# EAGLE design berlingo synth (EAGLE 6.6.0)
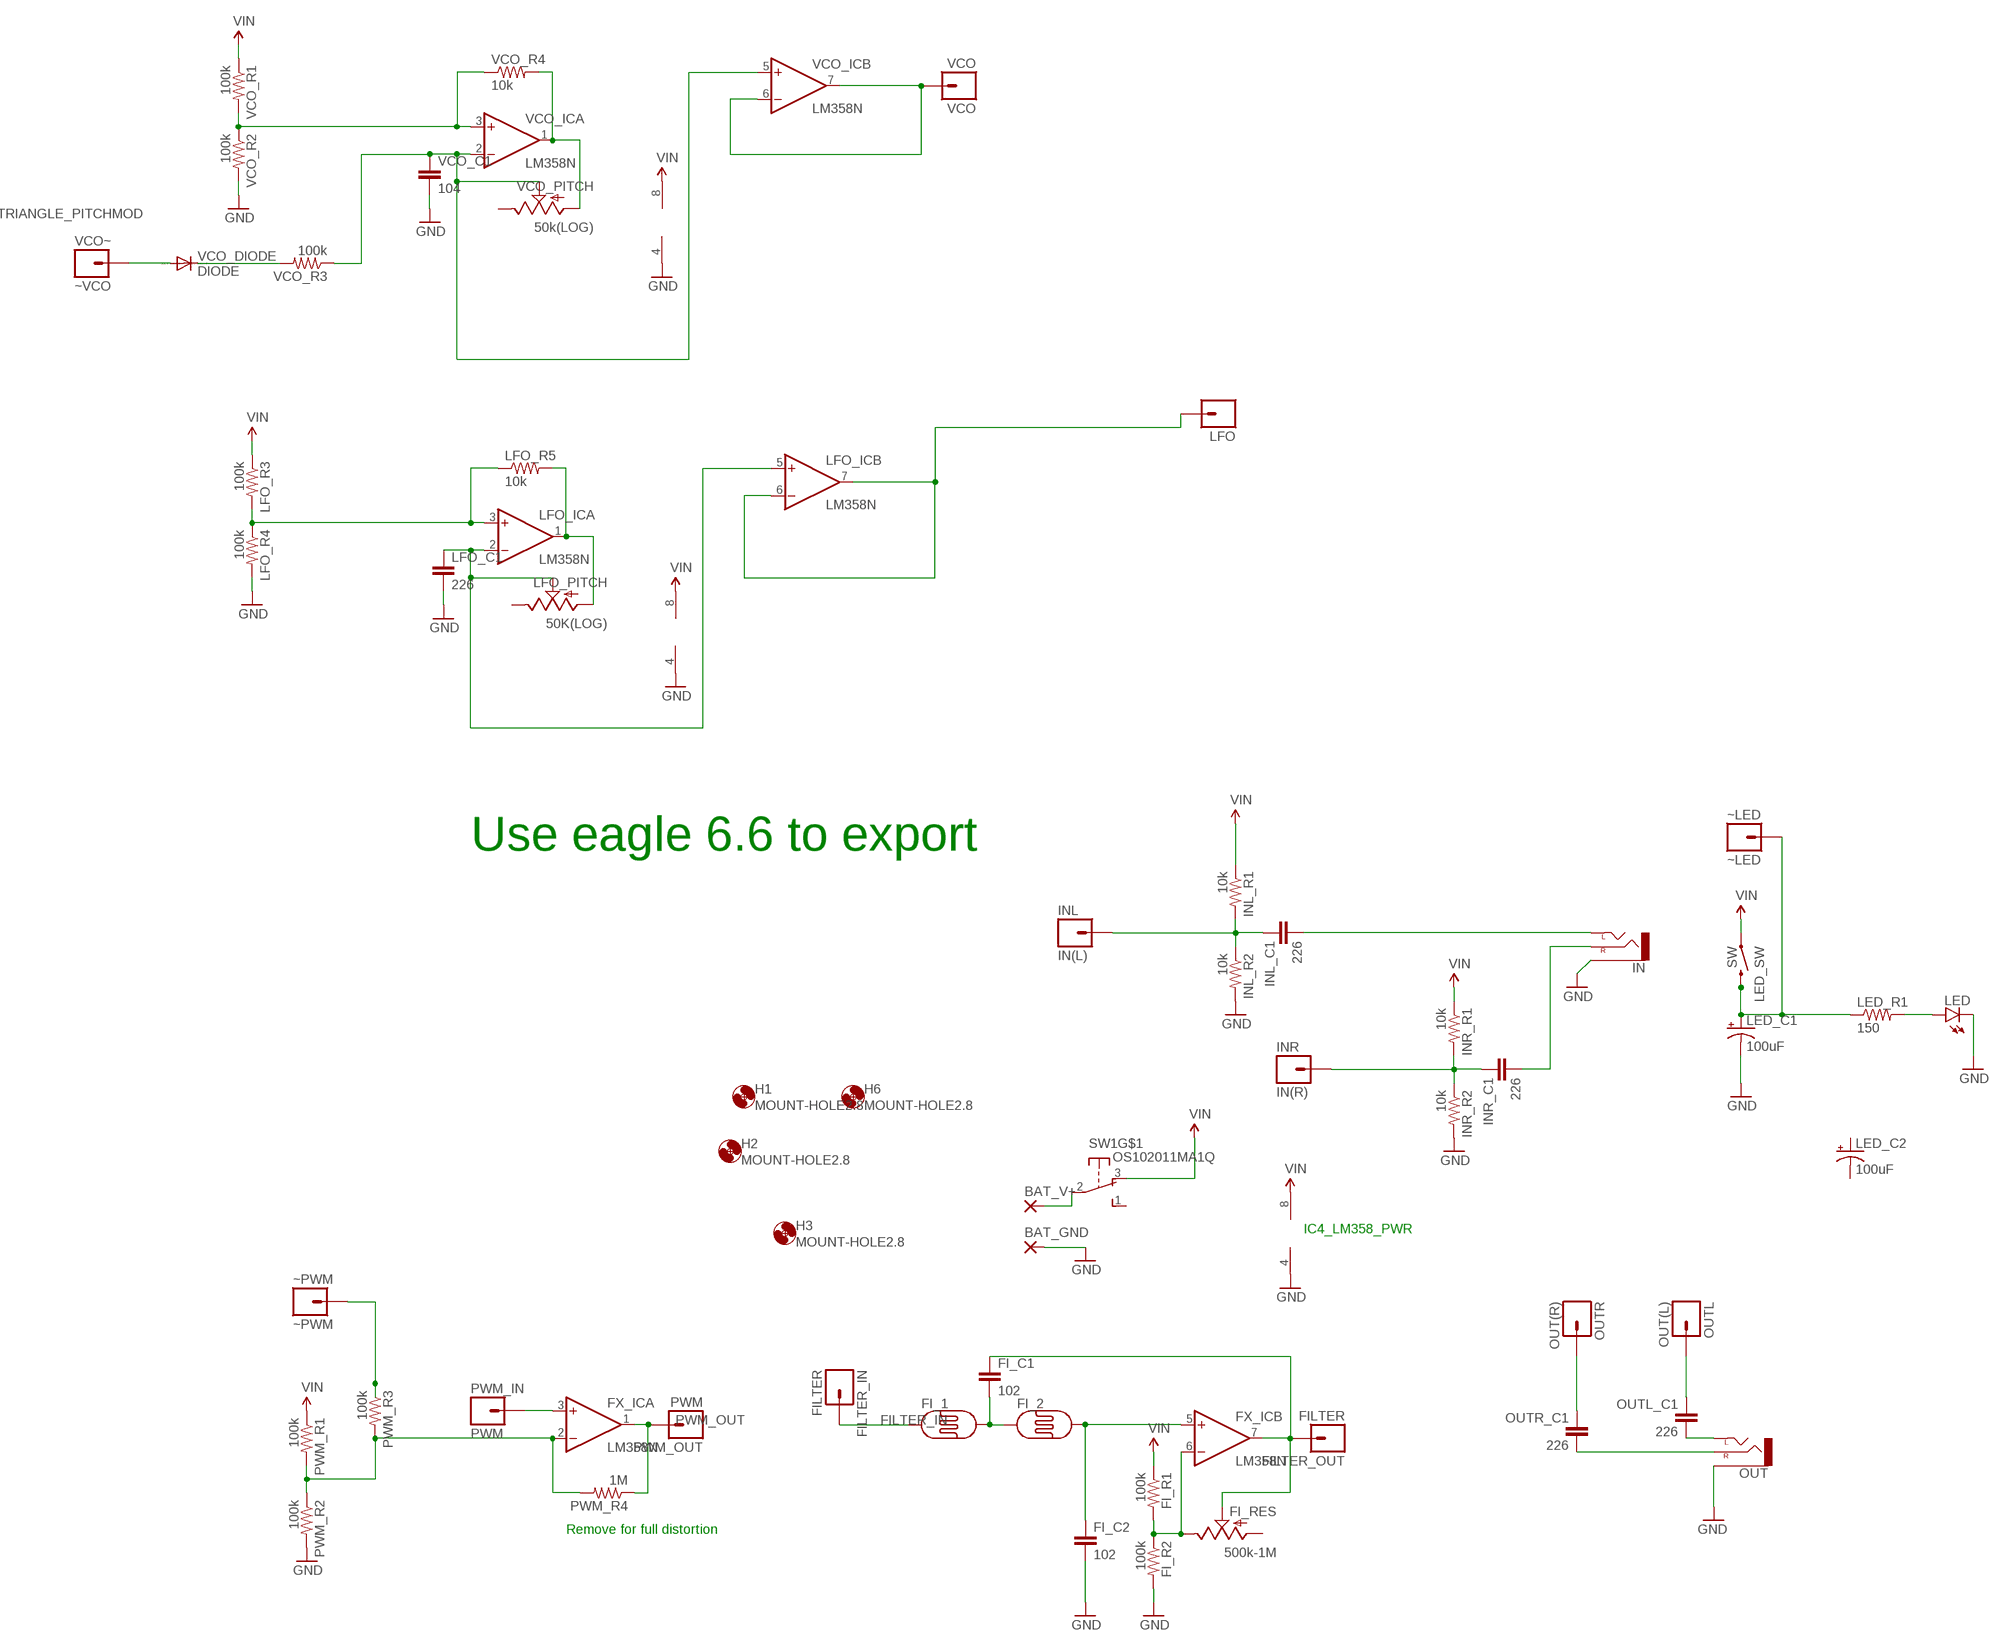
[diagram p0: schematic, sheet 1]

## Parts
BAT_GND  3,81/1,4  [3,81/1,4]
BAT_V+  3,81/1,4  [3,81/1,4]
FI_1  PHOTOCELLPTH  [PHOTOCELL]
FI_2  PHOTOCELLPTH  [PHOTOCELL]
FI_C1  102  CAPEZ  [CAP-PTH-SMALLEZ]
FI_C2  102  CAPEZ  [CAP-PTH-SMALLEZ]
FI_R1  100k  R-US_0207/10  [0207/10]
FI_R2  100k  R-US_0207/10  [0207/10]
FI_RES  500k-1M  POT  [ALPS_POT]
FILTER_IN  FILTER  HEADER-1X1  [1X01_SIDE_NAME]
FILTER_OUT  FILTER  HEADER-1X1  [1X01_SIDE_NAME]
FX_IC  LM358N  [DIL08]
H1  MOUNT-HOLE2.8  [2,8]
H2  MOUNT-HOLE2.8  [2,8]
H3  MOUNT-HOLE2.8  [2,8]
H6  MOUNT-HOLE2.8  [2,8]
IN  AUDIO-JACKPTH  [AUDIO-JACK]
INL  IN(L)  HEADER-1X1  [1X01_SIDE_NAME]
INL_C1  226  CAPEZ  [CAP-PTH-SMALLEZ]
INL_R1  10k  R-US_0207/10  [0207/10]
INL_R2  10k  R-US_0207/10  [0207/10]
INR  IN(R)  HEADER-1X1  [1X01_SIDE_NAME]
INR_C1  226  CAPEZ  [CAP-PTH-SMALLEZ]
INR_R1  10k  R-US_0207/10  [0207/10]
INR_R2  10k  R-US_0207/10  [0207/10]
LED  LED5MM  [LED5MM]
LED_C1  100uF  CPOL-USE2-4  [E2-4]
LED_C2  100uF  CPOL-USE2.5-6  [E2,5-6]
LED_R1  150  R-US_0207/10  [0207/10]
LED_SW  SW  SWITCH-MOMENTARY-212MM  [TACTILE-PTH-12MM]
LFO  HEADER-1X1  [1X01_SIDE_NAME]
LFO_C1  226  CAPEZ  [CAP-PTH-SMALLEZ]
LFO_IC  LM358N  [DIL08]
LFO_PITCH  50K(LOG)  POT  [ALPS_POT]
LFO_R3  100k  R-US_0207/10  [0207/10]
LFO_R4  100k  R-US_0207/10  [0207/10]
LFO_R5  10k  R-US_0207/10  [0207/10]
OUT  AUDIO-JACKPTH  [AUDIO-JACK]
OUTL  OUT(L)  HEADER-1X1  [1X01_SIDE_NAME]
OUTL_C1  226  CAPEZ  [CAP-PTH-SMALLEZ]
OUTR  OUT(R)  HEADER-1X1  [1X01_SIDE_NAME]
OUTR_C1  226  CAPEZ  [CAP-PTH-SMALLEZ]
PWM_IN  PWM  HEADER-1X1  [1X01_SIDE_NAME]
PWM_OUT  PWM  HEADER-1X1  [1X01_SIDE_NAME]
PWM_R1  100k  R-US_0207/10  [0207/10]
PWM_R2  100k  R-US_0207/10  [0207/10]
PWM_R3  100k  R-US_0207/10  [0207/10]
PWM_R4  1M  R-US_0207/10  [0207/10]
SW1  OS102011MA1Q  [OS102011MA1Q]
VCO  VCO  HEADER-1X1  [1X01_SIDE_NAME]
VCO_C1  104  CAPEZ  [CAP-PTH-SMALLEZ]
VCO_DIODE  DIODE  1N4004  [DO41-10]
VCO_IC  LM358N  [DIL08]
VCO_PITCH  50k(LOG)  POT  [ALPS_POT]
VCO_R1  100k  R-US_0207/10  [0207/10]
VCO_R2  100k  R-US_0207/10  [0207/10]
VCO_R3  100k  R-US_0207/10  [0207/10]
VCO_R4  10k  R-US_0207/10  [0207/10]
VCO~  ~VCO  HEADER-1X1  [1X01_SIDE_NAME]
~LED  ~LED  HEADER-1X1  [1X01_SIDE_NAME]
~PWM  ~PWM  HEADER-1X1  [1X01_SIDE_NAME]

## Nets
FILTER_IN: FI_1.1 FILTER_IN.1
FILTER_OUT: FI_C1.1 FI_RES.P$2(S) FILTER_OUT.1 FX_IC.7(B:OUT)
GND: BAT_GND.1(P) FI_C2.2 FI_R2.2 FX_IC.4(P:V-) IN.SLEEVE INL_R2.2 INR_R2.2 LED.K(C) LED_C1.- LFO_C1.2 LFO_IC.4(P:V-) LFO_R4.2 OUT.SLEEVE PWM_R2.2 VCO_C1.2 VCO_IC.4(P:V-) VCO_R2.2
LFO: LFO.1 LFO_IC.6(B:-IN) LFO_IC.7(B:OUT)
MOD_IN: FX_IC.3(A:+IN) PWM_IN.1
N$1: BAT_V+.1(P) SW1.2(P)
N$2: VCO_DIODE.C VCO_R3.2
N$3: FX_IC.2(A:-IN) PWM_R1.2 PWM_R2.1 PWM_R3.2 PWM_R4.2
N$4: VCO_IC.3(A:+IN) VCO_R1.2 VCO_R2.1 VCO_R4.1
N$5: PWM_R3.1 ~PWM.1
N$6: LED.A LED_R1.2
N$7: FI_2.2 FI_C2.1 FX_IC.5(B:+IN)
N$8: FI_1.2 FI_2.1 FI_C1.2
N$9: OUTR.1 OUTR_C1.1
N$10: VCO_IC.1(A:OUT) VCO_PITCH.P$3(A) VCO_R4.2
N$11: OUT.TIP(LEFT) OUTL_C1.2
N$12: OUTL.1 OUTL_C1.1
N$13: LED_C1.+ LED_R1.1 LED_SW.3 ~LED.1
N$14: INR.1 INR_C1.1 INR_R1.2 INR_R2.1
N$15: IN.RING(RIGHT) INR_C1.2
N$16: FI_R1.2 FI_R2.1 FI_RES.P$1(E) FX_IC.6(B:-IN)
N$17: LFO_IC.3(A:+IN) LFO_R3.2 LFO_R4.1 LFO_R5.1
N$18: VCO_C1.1 VCO_IC.2(A:-IN) VCO_IC.5(B:+IN) VCO_PITCH.P$2(S) VCO_R3.1
N$19: INL.1 INL_C1.1 INL_R1.2 INL_R2.1
N$20: IN.TIP(LEFT) INL_C1.2
N$21: LFO_IC.1(A:OUT) LFO_PITCH.P$3(A) LFO_R5.2
N$22: LFO_C1.1 LFO_IC.2(A:-IN) LFO_IC.5(B:+IN) LFO_PITCH.P$2(S)
N$23: VCO.1 VCO_IC.6(B:-IN) VCO_IC.7(B:OUT)
N$24: OUT.RING(RIGHT) OUTR_C1.2
PWM_OUT: FX_IC.1(A:OUT) PWM_OUT.1 PWM_R4.1
TRIANGLE_PITCHMOD: VCO_DIODE.A VCO~.1
VIN: FI_R1.1 FX_IC.8(P:V+) INL_R1.1 INR_R1.1 LED_SW.1 LFO_IC.8(P:V+) LFO_R3.1 PWM_R1.1 SW1.3(O) VCO_IC.8(P:V+) VCO_R1.1
Unconnected: FI_RES.P$3(A) LED_C2.+ LED_C2.- LFO_PITCH.P$1(E) SW1.1(S) SW1.MT1(MT) SW1.MT2(MT) VCO_PITCH.P$1(E)

## Notes on the sheet
- Use eagle 6.6 to export
- IC4_LM358_PWR
- Remove for full distortion

## Library data of the parts
BAT_GND BAT_V+ = wirepad:3,81/1,4: THROUGH-HOLE PAD
FI_1 FI_2 = SparkFun-Sensors:PHOTOCELL: CdS photoresistor. This is a low cost way to detect light levels. Resistance decreases with more incoming light. SparkFun SKU: SEN-09088
FI_C1 FI_C2 INL_C1 INR_C1 LFO_C1 OUTL_C1 OUTR_C1 VCO_C1 = SparkFun-Capacitors:CAP: Capacitor Standard 0603 ceramic capacitor, and 0.1" leaded capacitor.
FI_R1 FI_R2 INL_R1 INL_R2 INR_R1 INR_R2 LED_R1 LFO_R3-LFO_R5 PWM_R1-PWM_R4 VCO_R1-VCO_R4 = resistor:R-US_: RESISTOR, American symbol
FI_RES LFO_PITCH VCO_PITCH = SparkFun-Electromechanical:POT; PROD_ID: RES-09177
FILTER_IN FILTER_OUT INL INR LFO OUTL OUTR PWM_IN PWM_OUT VCO VCO~ ~LED ~PWM = TOF:HEADER-1X1: Header 1 Standard 1-pin 0.1" header. Use with straight break away headers (SKU : PRT-00116), right angle break away headers (PRT-00553), swiss pins (PRT-00743), machine pins (PRT-00117), and female headers (PRT-00115).
FX_IC LFO_IC VCO_IC = linear:LM358: OP AMP also LM158; LM258; LM2904 Source: http://cache.national.com/ds/LM/LM158.pdf
H1-H3 H6 = holes:MOUNT-HOLE: MOUNTING HOLE with drill center marker
IN OUT = SparkFun-Connectors:AUDIO-JACK: 3.5mm Audio Jack Simple 3.5mm common PCB mount audio jack. Variant PTH is our storefront SKU PRT-08032
LED = SparkFun-LED:LED: LEDs Standard schematic elements and footprints for 5mm, 3mm, 1206, and 0603 sized LEDs. 5mm - Spark Fun Electronics SKU : COM-00529 (and others)
LED_C1 LED_C2 = rcl:CPOL-US: POLARIZED CAPACITOR, American symbol
LED_SW = SparkFun-Electromechanical:SWITCH-MOMENTARY-2: Various NO switches- pushbuttons, reed, etc; PROD_ID: SWCH-09185
SW1 = adafruit:OS102011MA1Q: OS10201MA1Q through-hole right angle switch http://www.ladyada.net/library/eagle
VCO_DIODE = diode:1N4004: DIODE general purpose rectifier, 1 A

## Board
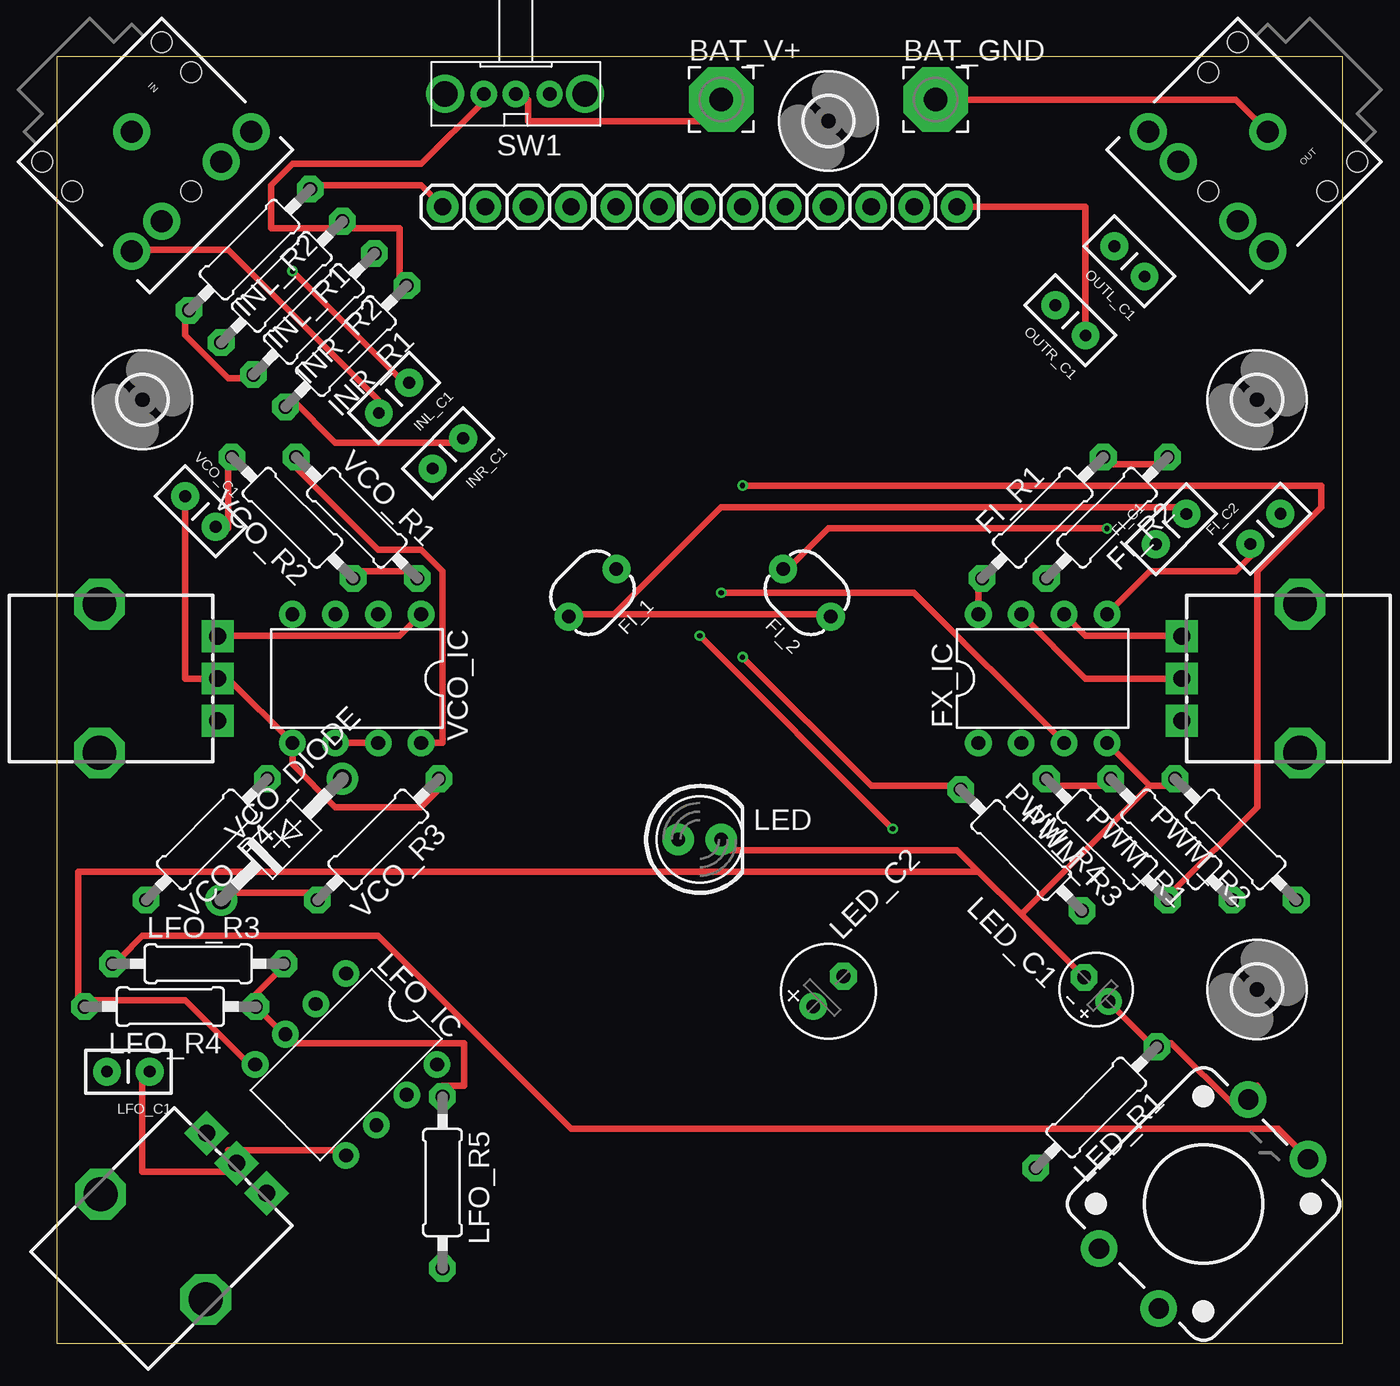
[diagram p1: board, top side]
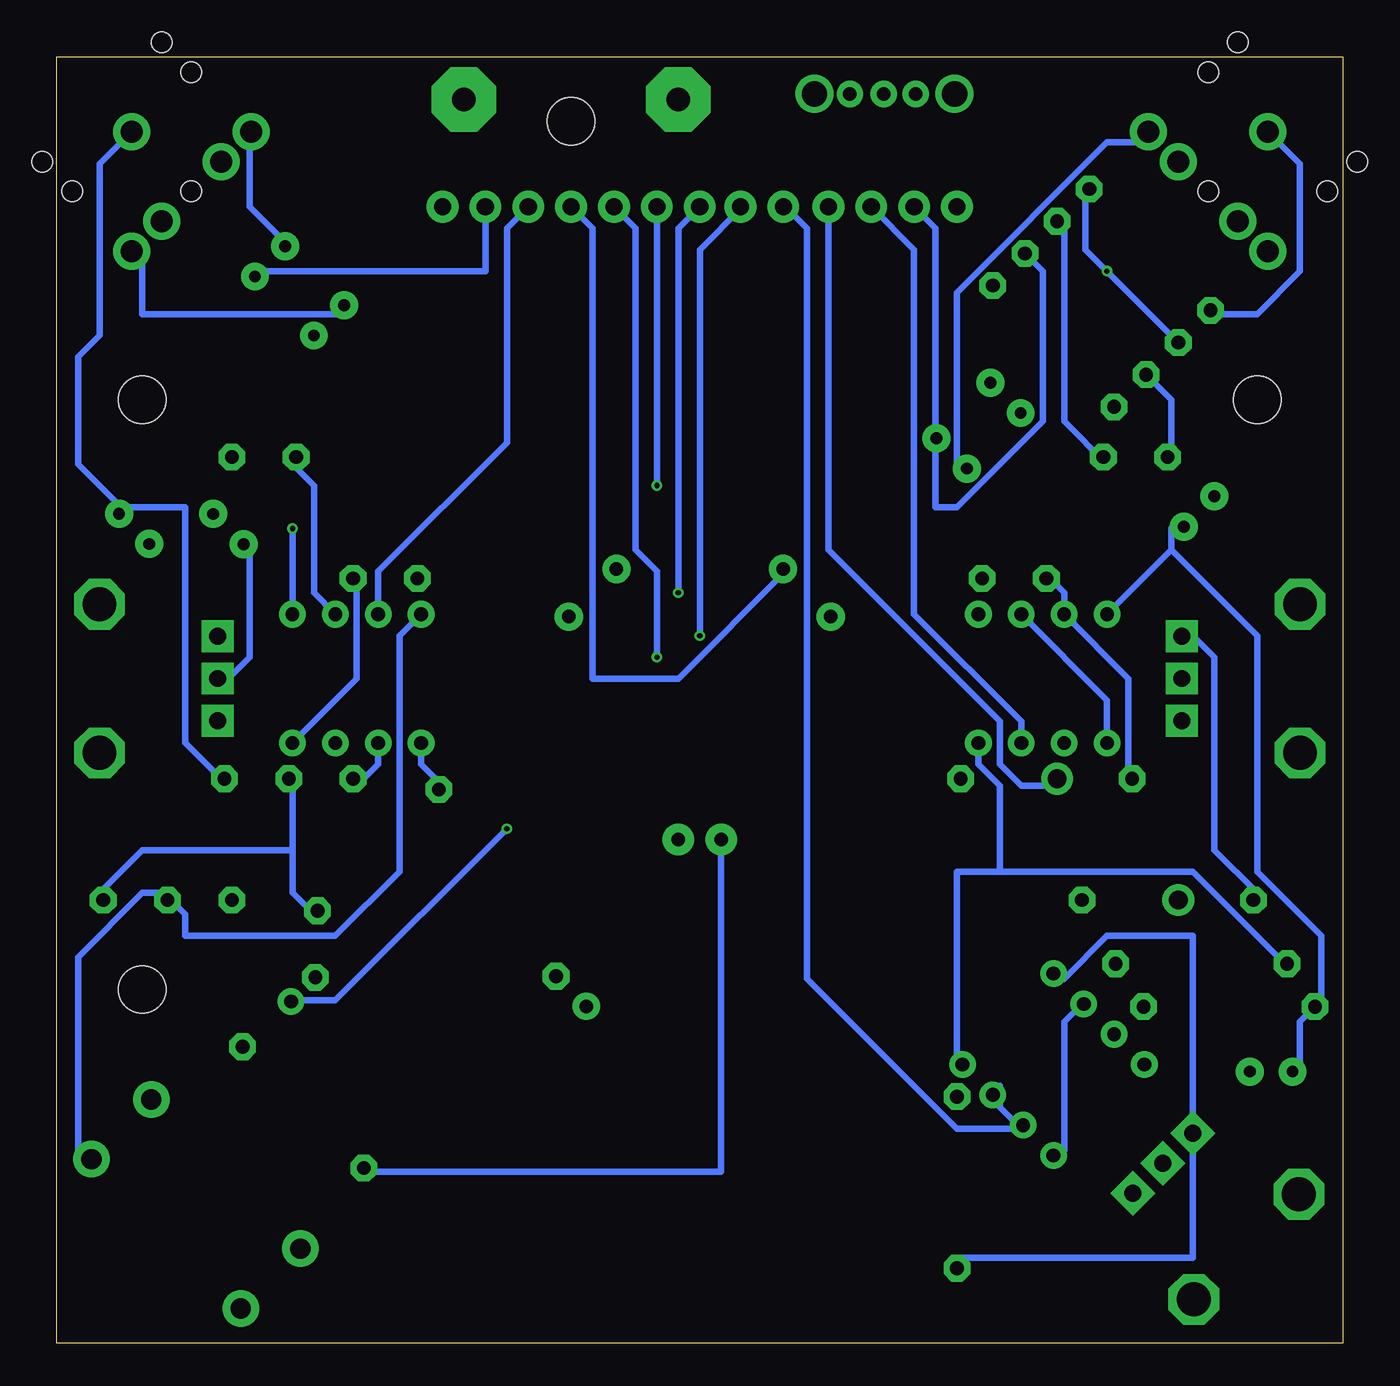
[diagram p2: board, bottom side, seen from below]

Size 76.2 x 76.2 mm. Coordinates in mm from the lower left corner, seen from the top.
Outline: 0,0 76.2,0 76.2,76.2 0,76.2 0,0
Copper layers (1*16): Top 0.035mm / dielectric 1.5mm / Bottom 0.035mm
Design rules "EagleRules *": minimum track width 15mil, minimum drill 12mil, track to track 7mil, track to pad 7mil, pad to pad 7mil, via to via 7mil, smd to smd 0mil, copper to edge 20mil, drill to drill 10mil, minimum pad ring 15mil, minimum via ring 6mil, stop-mask expansion 2mil, vias tented up to drill 25mil, thermal gap 10mil

### Footprints (pad centres in the part's own frame; a part is rotated, then mirrored left to right if it is on the bottom)
3,81/1,4 = drill 1.397 pad 3.81 octagon: 1 0,0
PHOTOCELL = drill 0.8 pad 1.676: 1 -2,0; 2 2,0
CAP-PTH-SMALLEZ = drill 0.7 pad 1.651: 1 0,0; 2 2.54,0
0207/10 = drill 0.813 octagon: 1 -5.08,0; 2 5.08,0
ALPS_POT = drill 1 pad 1.88 square: P$1 7,-2.5; P$2 7,0; P$3 7,2.5 | drill 2 octagon: P$4 0,-4.4; P$5 0,4.4
1X01_SIDE_NAME = drill 1.016 pad 1.88: 1 0,0
DIL08 = drill 0.813 pad 1.27: 1 -3.81,-3.81; 2 -1.27,-3.81; 3 1.27,-3.81; 4 3.81,-3.81; 5 3.81,3.81; 6 1.27,3.81; 7 -1.27,3.81; 8 -3.81,3.81
2,8 = hole 2.8: 0,0
AUDIO-JACK = drill 1.3 pad 2.184: RING 5,5; RSH 5,2.5; SLEEVE 0,0; TIP 5,-5; TSH 5,-2.5 | hole 1.2: 0,5; -2.5,5; -2.5,-5; 0,-5; 5,0
LED5MM = drill 0.813 pad 1.88: A -1.27,0; K 1.27,0
E2-4 = drill 0.813 pad 1.27: + -1.016,0 | drill 0.813 pad 1.27 octagon: - 1.016,0
E2,5-6 = drill 0.813 pad 1.6: + -1.27,0 | drill 0.813 pad 1.6 octagon: - 1.27,0
TACTILE-PTH-12MM = drill 1.2 pad 2.159: 1 6.25,-2.5; 2 -6.25,-2.5; 3 6.25,2.5; 4 -6.25,2.5
OS102011MA1Q = drill 0.8 pad 1.422: 1 -2,0; 2 0,0; 3 1.9,0 | drill 1.5 pad 2.184: MT1 -4.1,0; MT2 4.2,0
DO41-10 = drill 1.118: A 5.08,0; C -5.08,0

### Placement (x,y rotation side)
BAT_GND  52.07,73.66 0 top
BAT_V+  39.37,73.66 0 top
FI_1  31.75,44.45 225 top
FI_2  44.45,44.45 135 top
FI_C1  65.12,47.32 45 top
FI_C2  70.71,47.34 45 top
FI_R1  58.42,48.9 45 top
FI_R2  62.23,48.9 225 top
FI_RES  73.66,39.37 180 top
FILTER_IN  45.72,67.31 270 top
FILTER_OUT  48.26,67.31 270 top
FX_IC  58.42,39.37 0 top
H1  71.12,55.88 0 top
H2  71.12,20.95 0 top
H3  45.72,72.39 0 top
H6  5.08,55.88 0 top
IN  4.45,71.75 315 top
INL  22.86,67.31 270 top
INL_C1  20.88,56.9 225 top
INL_R1  13.34,62.87 225 top
INL_R2  11.43,64.77 225 top
INR  25.4,67.31 270 top
INR_C1  24.08,53.6 225 top
INR_R1  17.14,59.05 225 top
INR_R2  15.24,60.96 225 top
LED  38.1,29.84 0 top
LED_C1  61.59,20.95 135 top
LED_C2  45.72,20.85 45 top
LED_R1  61.59,13.97 225 top
LED_SW  67.94,8.26 45 top
LFO  33.15,67.31 270 top
LFO_C1  5.52,16.09 180 top
LFO_IC  17.14,16.51 225 top
LFO_PITCH  5.71,5.71 45 top
LFO_R3  8.38,22.48 0 top
LFO_R4  6.73,19.94 180 top
LFO_R5  22.86,9.53 270 top
OUT  71.75,71.75 225 top
OUTL  50.8,67.31 270 top
OUTL_C1  64.45,63.18 135 top
OUTR  53.34,67.31 270 top
OUTR_C1  60.96,59.69 135 top
PWM_IN  38.1,67.31 270 top
PWM_OUT  43.18,67.31 270 top
PWM_R1  66.04,29.84 135 top
PWM_R2  69.85,29.84 135 top
PWM_R3  62.23,29.84 135 top
PWM_R4  57.15,29.21 315 top
SW1  27.2,74 180 top
VCO  27.94,67.31 270 top
VCO_C1  7.62,50.16 315 top
VCO_DIODE  13.34,29.84 45 top
VCO_IC  17.78,39.37 180 top
VCO_PITCH  2.54,39.37 0 top
VCO_R1  17.78,48.9 315 top
VCO_R2  13.97,48.9 135 top
VCO_R3  19.05,29.84 225 top
VCO_R4  8.89,29.84 225 top
VCO~  30.48,67.31 270 top
~LED  35.69,67.31 270 top
~PWM  40.64,67.31 270 top

### Tracks (layer width: path | path; a pad name or v marks a point on that pad's centre or on a via)
FILTER_IN
  Bottom 0.381: FILTER_IN.1 44.45,66.04 44.45,39.37 39.37,39.37 33.02,45.72 FI_1.1
FILTER_OUT
  Top 0.381: FX_IC.7 60.96,39.37 FI_RES.P$2
  Bottom 0.381: FI_C1.1 64.77,46.99 64.77,40.64 66.04,39.37 FI_RES.P$2 | FILTER_OUT.1 49.53,66.04 49.53,53.34 57.15,45.72 FX_IC.7
GND
  Top 0.381: VCO_R2.2 10.16,52.07 10.16,48.26 VCO_C1.2 | INL_R2.2 7.62,60.96 7.62,59.69 10.16,57.15 11.43,57.15 INR_R2.2 | OUT.SLEEVE 69.85,73.66 BAT_GND.1 | 64.77,33.02 FX_IC.4 | 64.77,33.02 66.04,33.02 PWM_R2.2 | 1.27,20.32 7.62,20.32 11.43,16.51 LFO_IC.4 | 54.61,27.94 53.34,29.21 39.37,29.21 LED.K | 54.61,27.94 57.15,25.4 | 57.15,25.4 LED_C1.- 60.96,21.59 | 1.27,20.32 1.27,27.94 54.61,27.94 | 1.27,20.32 LFO_R4.2 | 57.15,25.4 64.77,33.02
  Bottom 0.381: 10.16,46.99 VCO_IC.4 | 10.16,46.99 10.16,48.26 VCO_C1.2 | INR_R2.2 10.16,55.88 10.16,52.07 VCO_R2.2 | IN.SLEEVE 2.54,69.85 2.54,63.5 5.08,60.96 7.62,60.96 INL_R2.2 | FX_IC.4 58.42,39.37 58.42,45.72 FI_R2.2 | 72.39,49.53 68.58,49.53 68.58,35.56 66.04,33.02 PWM_R2.2 | LFO_C1.2 2.54,16.51 2.54,19.05 LFO_R4.2 1.27,20.32 1.27,24.13 5.08,27.94 5.08,41.91 10.16,46.99 | OUT.SLEEVE 73.66,69.85 73.66,59.69 74.93,58.42 74.93,52.07 72.39,49.53 | 72.39,49.53 FI_C2.2
LFO
  Bottom 0.381: 19.05,12.7 20.32,13.97 20.32,15.24 LFO_IC.7 | 19.05,12.7 22.86,12.7 31.75,21.59 31.75,66.04 33.02,67.31 LFO.1 | 19.05,12.7 LFO_IC.6
MOD_IN  (via drill 0.3)
  Top 0.381: FX_IC.3 50.8,44.45 v39.37,44.45
  Bottom 0.381: v39.37,44.45 39.37,66.04 PWM_IN.1
N$1
  Top 0.381: BAT_V+.1 38.1,72.39 27.94,72.39 27.94,73.66 SW1.2
N$2
  Top 0.381: VCO_R3.2 15.24,26.67 10.16,26.67 VCO_DIODE.C
N$3
  Top 0.381: PWM_R3.2 58.42,33.02 62.23,33.02 PWM_R1.2
  Bottom 0.381: FX_IC.2 57.15,34.29 58.42,33.02 PWM_R3.2 | 62.23,29.21 62.23,33.02 PWM_R1.2 | 62.23,29.21 62.23,26.67 60.96,25.4 PWM_R4.2 | 62.23,29.21 71.12,29.21 73.66,26.67 PWM_R2.1
N$4
  Top 0.381: VCO_R1.2 21.59,45.72 17.78,45.72 VCO_R2.1
  Bottom 0.381: VCO_R4.1 12.7,33.02 12.7,39.37 VCO_IC.3 16.51,44.45 17.78,45.72 VCO_R2.1
N$5  (via drill 0.3)
  Top 0.381: v40.64,50.8 74.93,50.8 74.93,49.53 71.12,45.72 71.12,31.75 66.04,26.67 PWM_R3.1
  Bottom 0.381: ~PWM.1 v40.64,50.8
N$6
  Bottom 0.381: LED.A 36.83,10.16 58.42,10.16 LED_R1.2
N$7  (via drill 0.3)
  Top 0.381: FX_IC.5 64.77,45.72 69.85,45.72 71.12,46.99 FI_C2.1 | v62.23,48.26 45.72,48.26 43.18,45.72 FI_2.2
  Bottom 0.381: FX_IC.5 v62.23,48.26
N$8
  Top 0.381: 33.02,43.18 39.37,49.53 67.31,49.53 FI_C1.2 | 33.02,43.18 30.48,43.18 FI_1.2 | 33.02,43.18 45.72,43.18 FI_2.1
N$9
  Top 0.381: OUTR_C1.1 60.96,67.31 OUTR.1
N$10
  Top 0.381: VCO_IC.1 20.32,41.91 10.16,41.91 VCO_PITCH.P$3
  Bottom 0.381: VCO_R4.2 5.08,26.67 7.62,29.21 7.62,40.64 8.89,41.91 VCO_PITCH.P$3
N$11
  Bottom 0.381: OUTL_C1.2 62.23,64.77 64.77,67.31 64.77,71.12 OUT.TIP
N$12
  Bottom 0.381: OUTL.1 50.8,63.5 64.77,63.5 OUTL_C1.1
N$13  (via drill 0.3)
  Top 0.381: 71.12,15.24 LED_SW.3 69.85,13.97 66.04,17.78 64.77,17.78 | 64.77,17.78 LED_C1.+ 62.23,20.32 | v49.53,30.48 v38.1,41.91 | 64.77,17.78 LED_R1.1
  Bottom 0.381: v38.1,41.91 38.1,64.77 35.56,67.31 ~LED.1 | v49.53,30.48 59.69,20.32 62.23,20.32 LED_C1.+
N$14
  Top 0.381: INR_R1.2 13.97,55.88 16.51,53.34 24.13,53.34 INR_C1.1
  Bottom 0.381: 24.13,53.34 24.13,49.53 22.86,49.53 17.78,54.61 17.78,63.5 INR_R2.1 19.05,64.77 | INR.1 24.13,66.04 24.13,53.34 | 24.13,53.34 INR_C1.1
N$15
  Bottom 0.381: INR_C1.2 22.86,52.07 22.86,62.23 13.97,71.12 11.43,71.12 IN.RING
N$16
  Top 0.381: FI_R1.2 62.23,52.07 66.04,52.07 FI_R2.1 | FX_IC.6 60.96,41.91 66.04,41.91 FI_RES.P$1
  Bottom 0.381: FX_IC.6 60.96,44.45 60.96,50.8 62.23,52.07 FI_R1.2
N$17
  Top 0.381: LFO_R3.2 13.97,22.86 11.43,20.32 LFO_R4.1 13.97,17.78 | 13.97,17.78 24.13,17.78 24.13,15.24 22.86,15.24 LFO_R5.1 | 13.97,17.78 LFO_IC.3
N$18
  Top 0.381: VCO_R3.1 22.86,33.02 21.59,31.75 16.51,31.75 13.97,34.29 VCO_IC.5 10.16,39.37 VCO_PITCH.P$2 7.62,39.37 VCO_C1.1
  Bottom 0.381: VCO_IC.2 13.97,38.1 VCO_IC.5
N$19  (via drill 0.3)
  Top 0.381: v13.97,63.5 20.32,57.15 INL_C1.1 | INL.1 21.59,68.58 15.24,68.58 INL_R2.1
  Bottom 0.381: INL_R1.2 v13.97,63.5 15.24,64.77 15.24,68.58 INL_R2.1
N$20
  Top 0.381: INL_C1.2 19.05,55.88 10.16,64.77 5.08,64.77 IN.TIP
N$21
  Bottom 0.381: LFO_R5.2 22.86,5.08 8.89,5.08 8.89,11.43 LFO_PITCH.P$3 8.89,12.7 8.89,24.13 13.97,24.13 16.51,21.59 LFO_IC.1
N$22
  Top 0.381: LFO_IC.5 16.51,11.43 10.16,11.43 LFO_PITCH.P$2 10.16,10.16 5.08,10.16 5.08,16.51 LFO_C1.1
  Bottom 0.381: LFO_IC.2 15.24,20.32 16.51,19.05 16.51,11.43 LFO_IC.5
N$23
  Top 0.381: VCO_IC.7 VCO_IC.6
  Bottom 0.381: VCO.1 25.4,64.77 25.4,43.18 19.05,36.83 VCO_IC.7
N$24
  Bottom 0.381: OUTR_C1.2 59.69,60.96 71.12,60.96 71.12,64.77 OUT.RING
PWM_OUT  (via drill 0.3)
  Top 0.381: v40.64,40.64 48.26,33.02 53.34,33.02 PWM_R4.1
  Bottom 0.381: FX_IC.1 54.61,34.29 53.34,33.02 PWM_R4.1 | PWM_OUT.1 41.91,66.04 41.91,46.99 40.64,45.72 v40.64,40.64
TRIANGLE_PITCHMOD
  Bottom 0.381: VCO~.1 30.48,46.99 20.32,36.83 20.32,34.29 19.05,33.02 17.78,33.02 VCO_DIODE.A
VIN
  Top 0.381: FX_IC.8 54.61,45.72 FI_R1.1 | 16.51,66.04 12.7,66.04 12.7,68.58 13.97,69.85 21.59,69.85 25.4,73.66 SW1.3 | 16.51,66.04 20.32,66.04 20.32,62.23 INR_R1.1 | 16.51,66.04 INL_R1.1 | VCO_IC.8 22.86,35.56 22.86,45.72 21.59,46.99 19.05,46.99 13.97,52.07 VCO_R1.1 | LED_SW.1 73.66,11.43 72.39,12.7 30.48,12.7 19.05,24.13 5.08,24.13 3.81,22.86 LFO_R3.1
  Bottom 0.381: 69.85,26.67 71.12,26.67 74.93,22.86 74.93,11.43 LED_SW.1 | FX_IC.8 55.88,41.91 55.88,27.94 59.69,24.13 68.58,24.13 68.58,25.4 69.85,26.67 | 69.85,26.67 PWM_R1.1 | VCO_R1.1 13.97,52.07 16.51,54.61 16.51,66.04 INL_R1.1 | 20.32,27.94 22.86,27.94 22.86,16.51 LFO_IC.8 | 20.32,27.94 8.89,27.94 3.81,22.86 LFO_R3.1 | VCO_IC.8 21.59,34.29 20.32,33.02 20.32,27.94

### Text on the board
tValues: ON | IN | V+ | GND | OUT | FILTER | RCO | 50K | 200K | VCO | PWM | 50K | LED | BERLINGO SYNTH 0.03 | LFO
Reference: Use eagle 6.6 to export!